# Altium project 无线充电发射端.PrjPcb
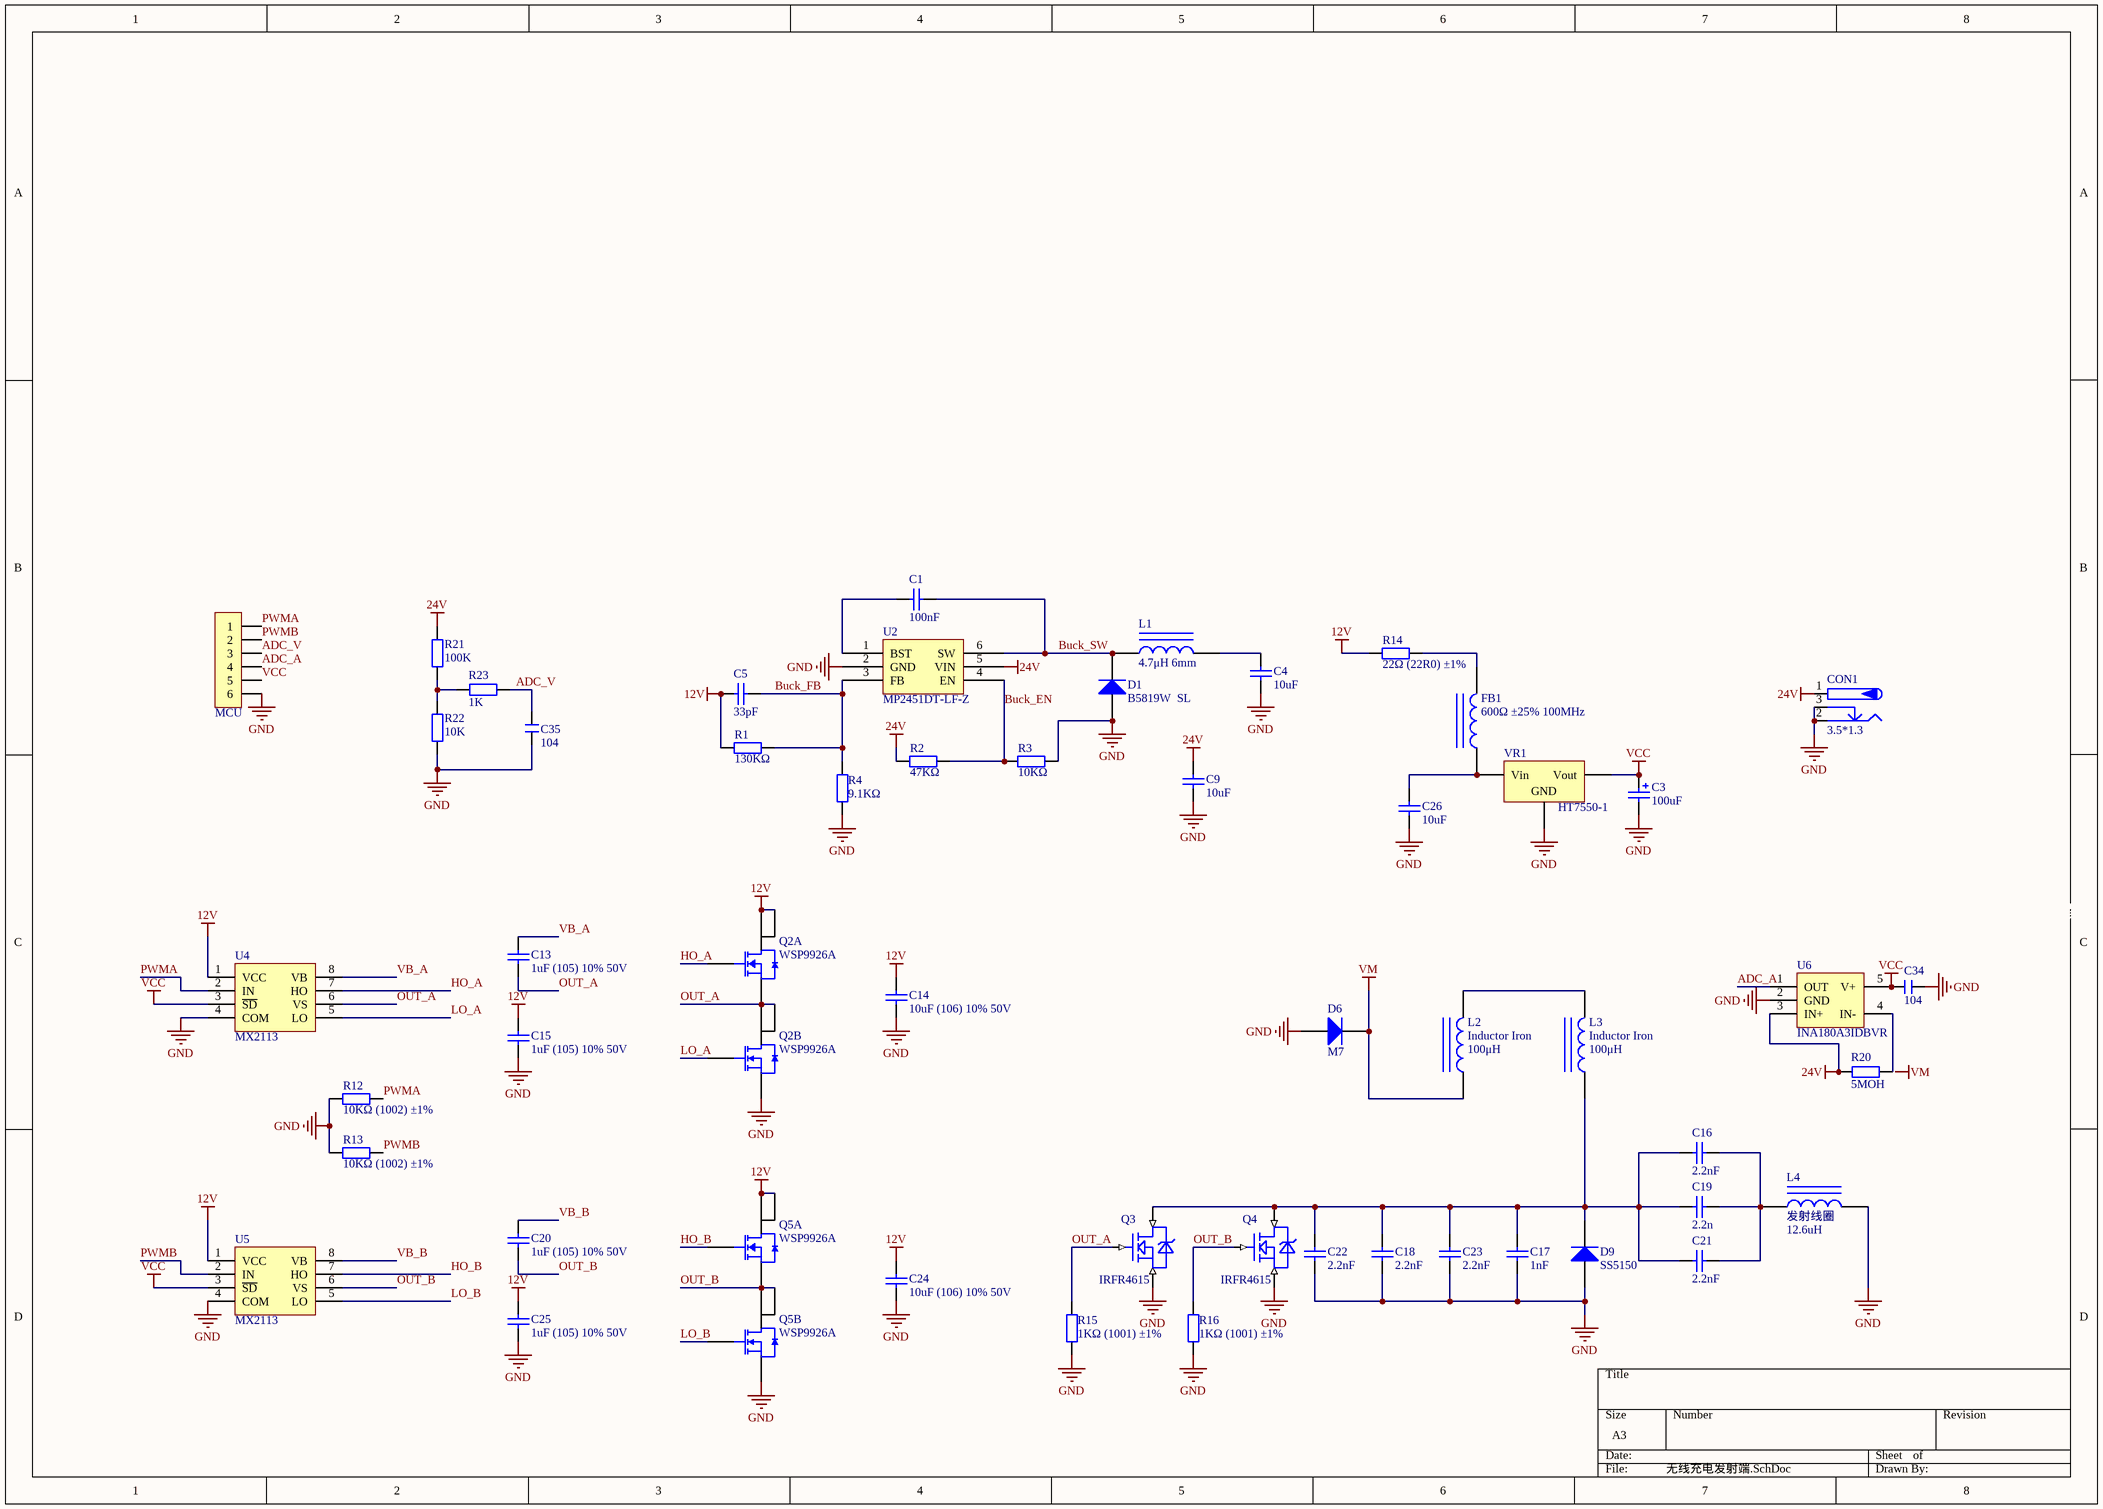
[diagram p0: 无线充电发射端.SchDoc]
1 sheet, 53 parts. Net scope: global (net labels, ports and power ports of the same name join across sheets).
Board file: 无线充电发射端.PcbDoc

## Sheet 无线充电发射端.SchDoc
size A3

### Parts
C1  100nF  [0603_C]
C3  100uF  [CASE-B_3528]
C4  10uF  [0805_C]
C5  33pF  [0603_C]
C9  10uF  [1206_C]
C13  1uF (105) 10% 50V  [0805_C]
C14  10uF (106) 10% 50V  [1206_C]
C15  1uF (105) 10% 50V  [0805_C]
C16  2.2nF  [1206_C]
C17  1nF  [C 1206]
C18  2.2nF  [C 1206]
C19  2.2n  [C 1206]
C20  1uF (105) 10% 50V  [0805_C]
C21  2.2nF  [C 1206]
C22  2.2nF  [1206_C]
C23  2.2nF  [C 1206]
C24  10uF (106) 10% 50V  [1206_C]
C25  1uF (105) 10% 50V  [0805_C]
C26  10uF  [0805_C]
C34  104  [C 0402]
C35  104  [C 0402]
CON1  3.5*1.3  [DC-005]
D1  B5819W  SL  [SOD-123]
D6  M7  [SMA(DO-214AC)_S1]
D9  SS5150  [SMC]
FB1  600Ω ±25% 100MHz  [0805_L]
L1  value 4.7μH 6mm  [L6*6]  (hidden comment: 磁屏蔽电感)
L2  Inductor Iron  value 100μH  [WHC1250]
L3  Inductor Iron  value 100μH  [WHC1250]
L4  发射线圈  value 12.6uH  [IND5X4]
MCU  HDR-1X6  [HDR-1X6]  (value not drawn)
Q2  WSP9926A  [SOP-8_150mil]  (parts A,B of 2)
Q3  IRFR4615  [TO-252]
Q4  IRFR4615  [TO-252]
Q5  WSP9926A  [SOP-8_150mil]  (parts A,B of 2)
R1  130KΩ  [0603_R]
R2  47KΩ  [0603_R]
R3  10KΩ  [0603_R]
R4  9.1KΩ  [0603_R]
R12  10KΩ (1002) ±1%  [0603_R]
R13  10KΩ (1002) ±1%  [0603_R]
R14  22Ω (22R0) ±1%  [1206_R]
R15  1KΩ (1001) ±1%  [0603_R]
R16  1KΩ (1001) ±1%  [0603_R]
R20  5MOH  [R 1206]
R21  100K  [R 0402]
R22  10K  [R 0402]
R23  1K  [R 0402]
U2  MP2451DT-LF-Z  [SOT-23-6]
U4  MX2113  [SOP8]
U5  MX2113  [SOP8]
U6  INA180A3IDBVR  [INA180A3IDBVR]
VR1  HT7550-1  [SOT-89(SOT-89-3)]

### Nets
12V: C5.1 C14.2 C15.2 C24.2 C25.2 Q2.7(D) Q2.8(D) Q5.7(D) Q5.8(D) R1.1 R14.1 U4.1(VCC) U5.1(VCC)
24V: C9.2 CON1.1 R2.1 R20.1 R21.2 U2.5(VIN) U6.3(IN+)
GND: C3.2 C4.1 C9.1 C14.1 C15.1 C17.1 C18.1 C22.1 C23.2 C24.1 C25.1 C26.1 C34.1 C35.1 CON1.2 CON1.3 D1.1(A) D6.1(A) D9.1(A) L4.2 MCU.6 Q2.3(S) Q3.3(S) Q4.3(S) Q5.3(S) R3.2 R4.1 R12.1 R13.1 R15.1 R16.1 R22.1 U2.2(GND) U4.4(COM) U5.4(COM) U6.2(GND) VR1.1(GND)
VCC: C3.1 C34.2 MCU.5 U4.3(~{SD}) U5.3(~{SD}) U6.5(V+) VR1.3(Vout)
VM: D6.2(K) L2.1
ADC_A: MCU.4 U6.1(OUT)
ADC_V: C35.2 MCU.3 R23.1
Buck_EN: R2.2 R3.1 U2.4(EN)
Buck_FB: C5.2 R1.2 R4.2 U2.3(FB)
Buck_SW: C1.2 D1.2(K) L1.1 U2.6(SW)
HO_A: Q2.2(G) U4.7(HO)
HO_B: Q5.2(G) U5.7(HO)
LO_A: Q2.4(G) U4.5(LO)
LO_B: Q5.4(G) U5.5(LO)
OUT_A: C13.1 Q2.1(S) Q2.5(D) Q2.6(D) Q3.1(G) R15.2 U4.6(VS)
OUT_B: C20.1 Q4.1(G) Q5.1(S) Q5.5(D) Q5.6(D) R16.2 U5.6(VS)
PWMA: MCU.1 R12.2 U4.2(IN)
PWMB: MCU.2 R13.2 U5.2(IN)
VB_A: C13.2 U4.8(VB)
VB_B: C20.2 U5.8(VB)
NetC1_1: C1.1 U2.1(BST)
NetC4_2: C4.2 L1.2
NetC16_1: C16.1 C19.1 C21.1 L4.1
NetC16_2: C16.2 C17.2 C18.2 C19.2 C21.2 C22.2 C23.1 D9.2(K) L3.1 Q3.2(D) Q4.2(D)
NetC26_2: C26.2 FB1.1 VR1.2(Vin)
NetFB1_2: FB1.2 R14.2
NetL2_2: L2.2 L3.2
NetR20_2: R20.2 U6.4(IN-)
NetR21_1: R21.1 R22.2 R23.2

### Notes on the sheet
- 我说它是螺丝，它就是螺丝
- Labels drawn without touching a wire or pin: VM

### Library data of the parts
C1 = 0603 100nF (104) 10% 50V: 贴片电容; ComponentLink1Description: 供应商链接; ComponentLink1URL: http://www.szlcsc.com/product/details_15331.html; Package: 0603; Supplier: LC; SuppliersPartNumber: C14663
C3 = 3528 100uF (107) 10% 6.3V: 钽电容; ComponentLink1Description: 供应商链接; ComponentLink1URL: http://www.szlcsc.com/product/details_16815.html; Package: 3528; Supplier: LC; SuppliersPartNumber: C16133
C4 C26 = 0805 10uF (106) 10% 25V: 贴片电容; ComponentLink1Description: 供应商链接; ComponentLink1URL: http://www.szlcsc.com/product/details_16532.html; Package: 0805; Supplier: LC; SuppliersPartNumber: C15850
C5 = 0603 33pF (330) 5% 50V: 贴片电容; ComponentLink1Description: 供应商链接; ComponentLink1URL: http://www.szlcsc.com/product/details_2015.html; Package: 0603; Supplier: LC; SuppliersPartNumber: C1663
C9 C14 C24 = 1206 10uF (106) 10% 50V: 贴片电容; ComponentLink1Description: 供应商链接; ComponentLink1URL: http://www.szlcsc.com/product/details_14236.html; Package: 1206; Supplier: LC; SuppliersPartNumber: C13585
C13 C15 C20 C25 = 0805 1uF (105) 10% 50V: 贴片电容; ComponentLink1Description: 供应商链接; ComponentLink1URL: http://www.szlcsc.com/product/details_29074.html; Package: 0805; Supplier: LC; SuppliersPartNumber: C28323
C16-C19 C21-C23 = 1206 1nF (102) 10% 500V: 贴片电容; ComponentLink1Description: 供应商链接; ComponentLink1URL: http://www.szlcsc.com/product/details_36187.html; Package: 1206; Supplier: LC; SuppliersPartNumber: C35216
C34 C35 = C: 无极性贴片电容; 版权归属: 源创客; BOM名称: 无极性贴片电容; 学习资源: www.ooocke.com
CON1 = P-DC: 低压电源接口; BOM名称: DC电源接口; 版权归属: 源创客; 学习资源: www.ooocke.com
D1 = SOD-123 B5819W  SL: 肖特基二极管; ComponentLink1Description: 供应商链接; ComponentLink1URL: http://www.szlcsc.com/product/details_9093.html; Package: SOD-123; Supplier: LC; SuppliersPartNumber: C8598
D6 = SMA(DO-214AC) M7: 二极管; 备注: 1N4007 4007 编号C2464 已经停售, 使用新物料编号C95872; ComponentLink1Description: 供应商链接; ComponentLink1URL: http://www.szlcsc.com/product/details_2841.html; Package: SMA(DO-214AC); Supplier: LC; SuppliersPartNumber: C95872
D9 = SMC(DO-214AB) SS36-E3/57T: 二极管; ComponentLink1Description: 供应商链接; ComponentLink1URL: https://item.szlcsc.com/66085.html; Supplier: LC; SuppliersPartNumber: C35722
FB1 = 0805 600Ω 25% 100MHz: 贴片磁珠; ComponentLink1Description: 供应商链接; ComponentLink1URL: http://www.szlcsc.com/product/details_1369.html; Package: 0805; Supplier: LC; SuppliersPartNumber: C1017
L1-L4 = Inductor Iron: Magnetic-Core Inductor
  L1: Published: 24-Mar-1999; LatestRevisionDate: 17-Jul-2002; LatestRevisionNote: Re-released for DXP Platform.; PackageReference: AXIAL-0.9; Publisher: Altium Limited; PackageDescription: Axial Device, Thru-Hole; 2 Leads; 0.9 in Pin Spacing; ComponentLink1URL: http://www.szlcsc.com/so/product/details_33649.html
  L2 L3: SuppliersPartNumber: C81470; ComponentLink1URL: https://item.szlcsc.com/82621.html; PackageReference: 12.5*12.5*7.5; Publisher: TDK
  L4: Published: 24-Mar-1999; LatestRevisionDate: 17-Jul-2002; LatestRevisionNote: Re-released for DXP Platform.; PackageReference: AXIAL-0.9; Publisher: Altium Limited; PackageDescription: Axial Device, Thru-Hole; 2 Leads; 0.9 in Pin Spacing
MCU = Header 6: 6P接插件; 版权归属: 源创客; BOM名称: 6P接插件; 学习资源: www.ooocke.com
Q2 Q5 = WSP9926B: MOS(场效应管); ComponentLink1Description: 供应商链接; ComponentLink1URL: https://item.szlcsc.com/87515.html; Package: SOP-8_150mil; Supplier: LC; SuppliersPartNumber: C20897
Q3 Q4 = IRF540
R1 = 0603 130KΩ (1303) 1%: 贴片电阻; ComponentLink1Description: 供应商链接; ComponentLink1URL: http://www.szlcsc.com/product/details_23522.html; Package: 0603; Supplier: LC; SuppliersPartNumber: C22795
R2 = 0603 47KΩ (4702) 1%: 贴片电阻; ComponentLink1Description: 供应商链接; ComponentLink1URL: http://www.szlcsc.com/product/details_26562.html; Package: 0603; Supplier: LC; SuppliersPartNumber: C25819
R3 R12 R13 = 0603 10KΩ (1002) 1%: 贴片电阻; ComponentLink1Description: 供应商链接; ComponentLink1URL: http://www.szlcsc.com/product/details_26547.html; Package: 0603; Supplier: LC; SuppliersPartNumber: C25804
R4 = 0603 9.1KΩ (9101) 1%: 贴片电阻; ComponentLink1Description: 供应商链接; ComponentLink1URL: http://www.szlcsc.com/product/details_23987.html; Package: 0603; Supplier: LC; SuppliersPartNumber: C23260
R14 = 1206 22Ω (22R0) 1%: 贴片电阻; ComponentLink1Description: 供应商链接; ComponentLink1URL: http://www.szlcsc.com/product/details_18646.html; Package: 1206; Supplier: LC; SuppliersPartNumber: C17958
R15 R16 = 0603 1KΩ (1001) 1%: 贴片电阻; ComponentLink1Description: 供应商链接; ComponentLink1URL: http://www.szlcsc.com/product/details_21904.html; Package: 0603; Supplier: LC; SuppliersPartNumber: C21190
R20-R23 = R: 贴片电阻; 版权归属: 源创客; BOM名称: 贴片电阻; 学习资源: www.ooocke.com
U2 = MP2451DT-LF-Z_[C14123]: DC-DC芯片; ComponentLink1Description: 供应商链接; ComponentLink1URL: http://www.szlcsc.com/product/details_14780.html; Package: SOT-23-6; Supplier: LC; SuppliersPartNumber: C14123
U4 U5 = IR2104
U6 = INA180A3IDBVR: sot23-5
VR1 = SOT-89 HT7550-1: 低压差线性稳压(LDO); ComponentLink1Description: 供应商链接; ComponentLink1URL: http://www.szlcsc.com/product/details_16788.html; Package: SOT-89; Supplier: LC; SuppliersPartNumber: C16106